# EasyEDA Pro project 500KHZ锁相环模块.eprj

# Schematic Schematic1
Board Name: Board1; Create Date: 2025-06-10; Page Name: P1; Project Name: 500KHZ锁相环模块; Schematic Name: Schematic1; Update Date: 2025-06-11; Company: 嘉立创EDA; Page Size: A4; Version: V1.0
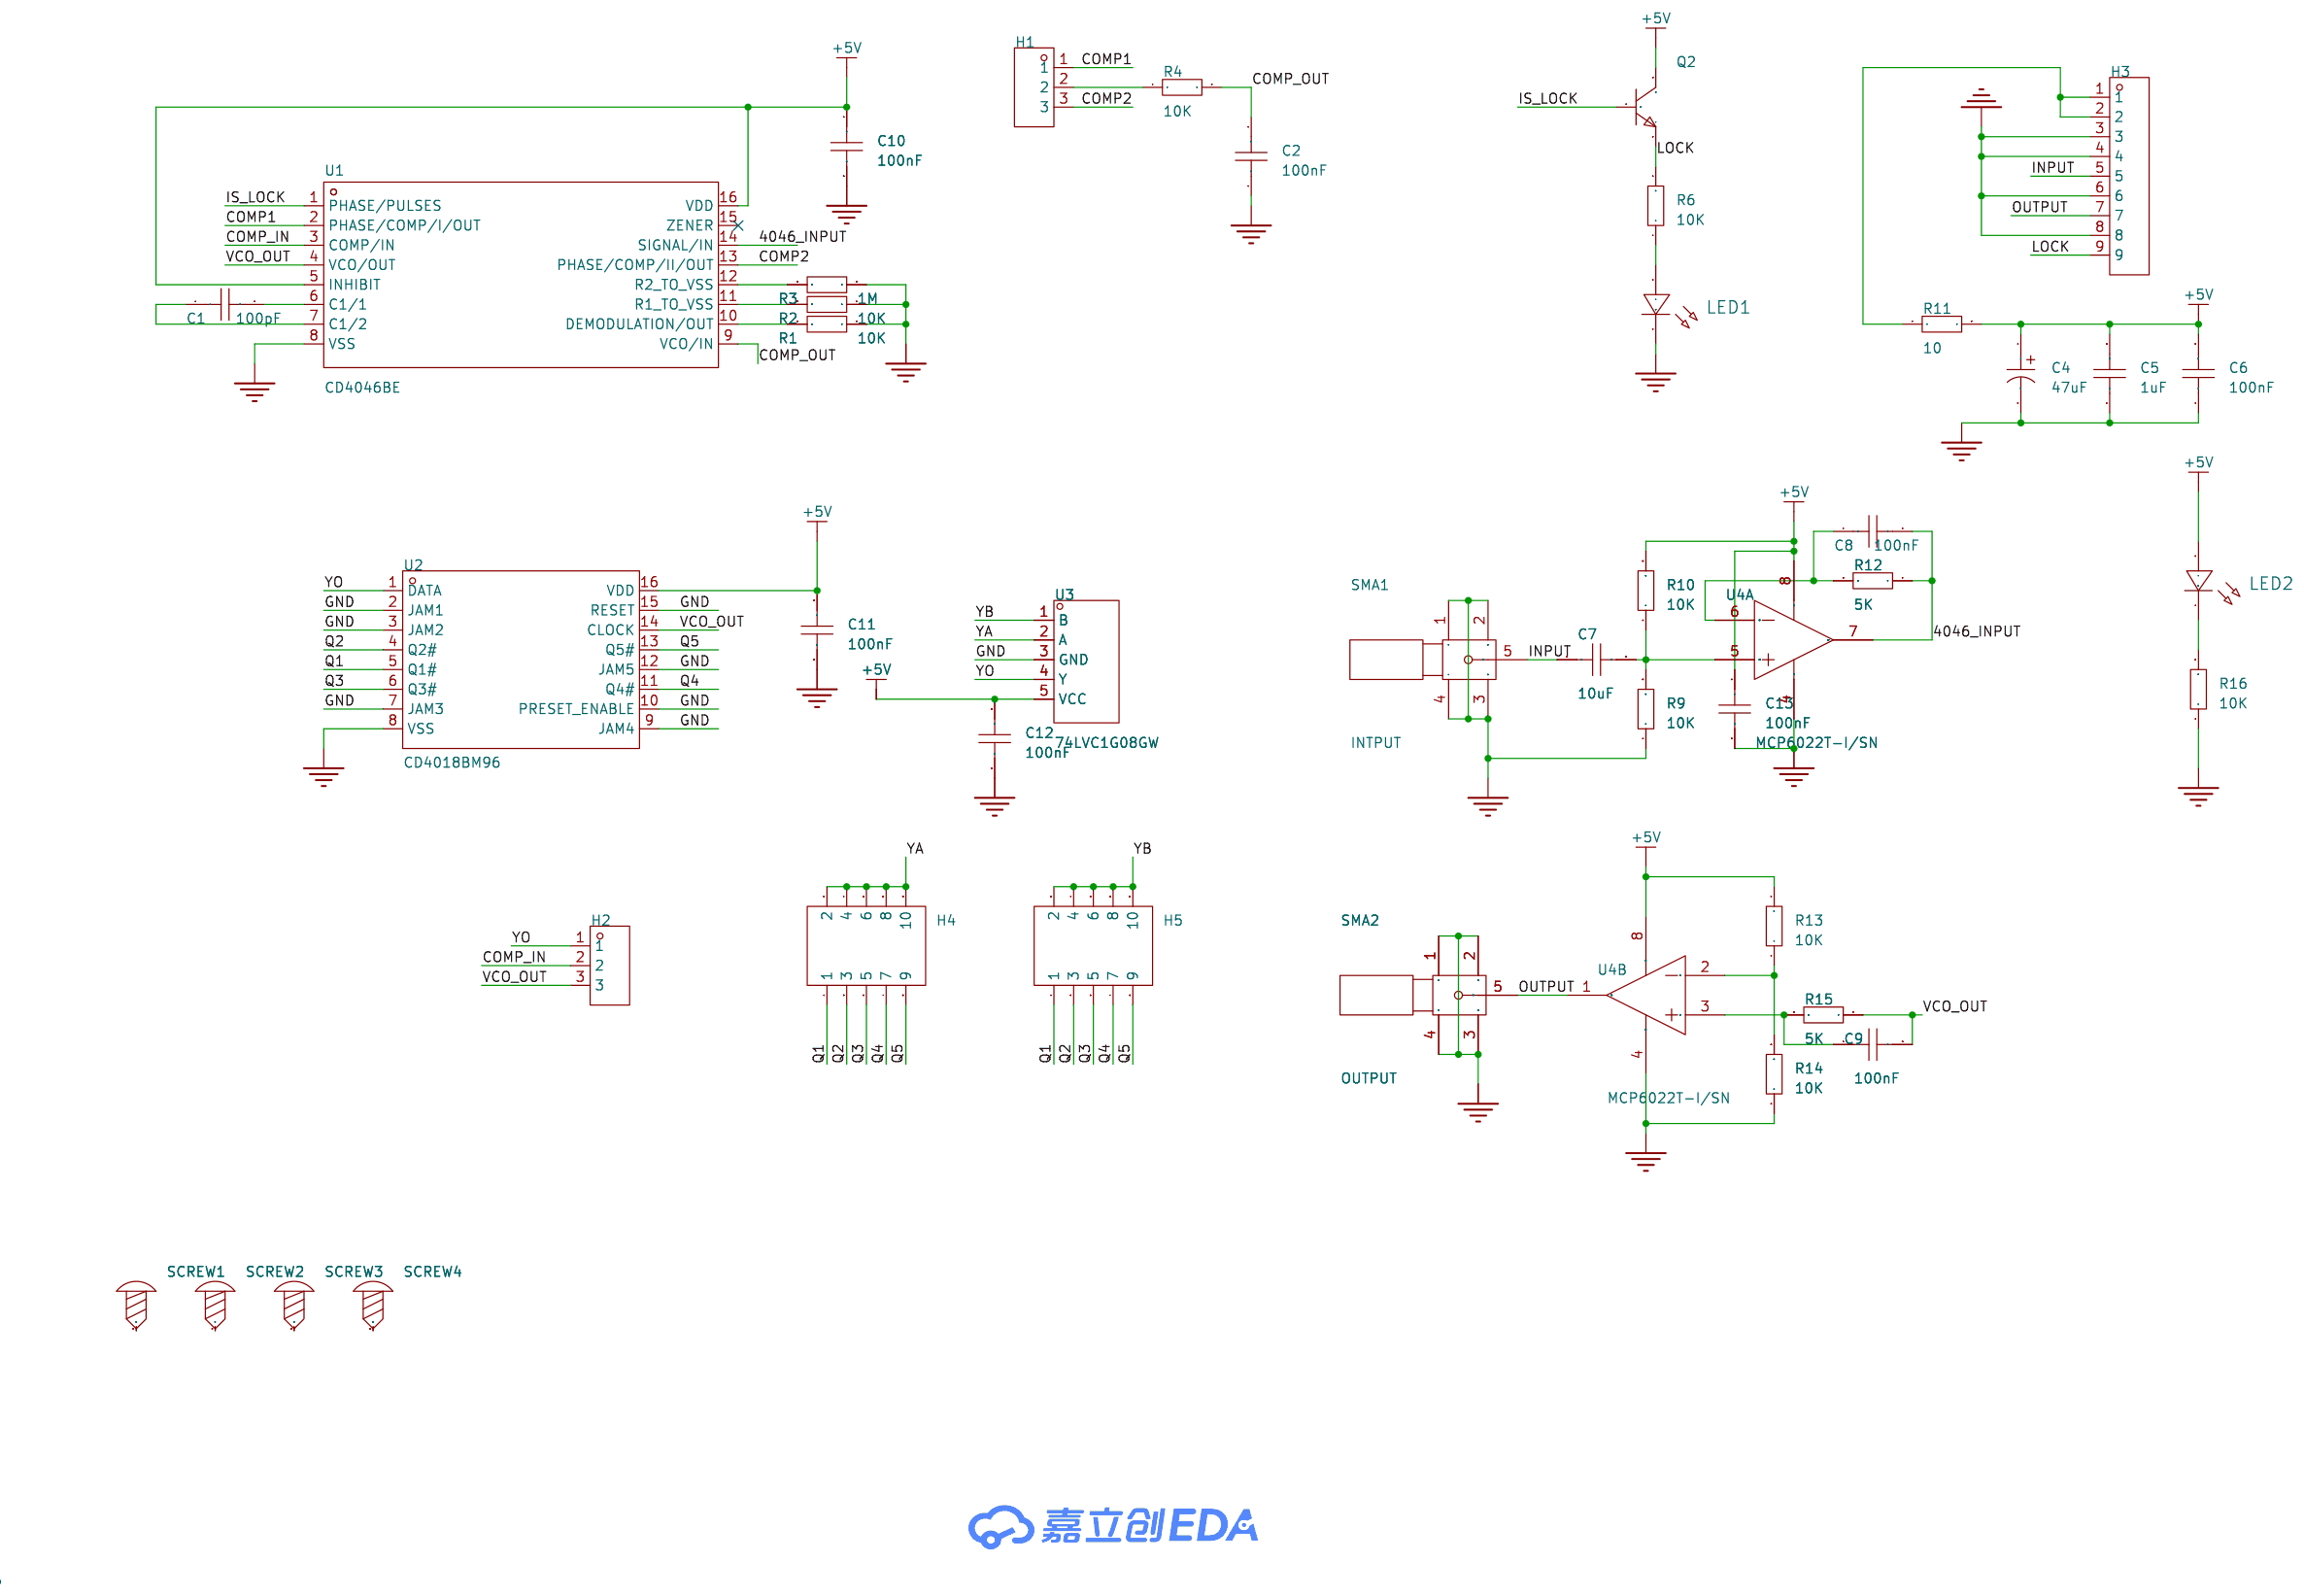
[diagram p0: schematic sheet]

## Parts
C1  100pF  [C0603]
C2  100nF  [C0603]
C4  47uF  [CAP-TH_BD6.3-P2.50-D0.5-FD]
C5  1uF  [C0603]
C6  100nF  [C0603]
C7  10uF  [C0603]
C8  100nF  [C0603]
C9  100nF  [C0603]
C10  100nF  [C0603]
C11  100nF  [C0603]
C12  100nF  [C0603]
C13  100nF  [C0603]
H1  -  [HDR-TH_3P-P2.54-V-M]
H2  -  [HDR-TH_3P-P2.54-V-M]
H3  -  [HDR-TH_9P-P2.54-V-M]
H4  -  [HDR-TH_10P-P2.54-V-F-R2-C5-S2.54]
H5  -  [HDR-TH_10P-P2.54-V-F-R2-C5-S2.54]
LED1  -  [LED_0603]
LED2  -  [LED_0603]
Q2  SS8050(RANGE:200-350)  [SOT-23-3_L2.9-W1.3-P1.90-LS2.4-BR]
R1  10K  [R0603]
R2  10K  [R0603]
R3  1M  [R0603]
R4  10K  [R0603]
R6  10K  [R0603]
R9  10K  [R0603]
R10  10K  [R0603]
R11  10  [R0603]
R12  5K  [R0603]
R13  10K  [R0603]
R14  10K  [R0603]
R15  5K  [R0603]
R16  10K  [R0603]
SCREW1  -  [M2螺丝]
SCREW2  -  [M2螺丝]
SCREW3  -  [M2螺丝]
SCREW4  -  [M2螺丝]
SMA1  INTPUT  [SMA-SMD_BWSMA-KE-P001]
SMA2  OUTPUT  [SMA-SMD_BWSMA-KE-P001]
U1  CD4046BE  [DIP-16_L19.7-W6.6-P2.54-LS10.9-BL]
U2  CD4018BM96  [SOIC-16_L9.9-W3.9-P1.27-LS6.0-BL]
U3  74LVC1G08GW  [SOT-353_L2.2-W1.4-P0.65-LS2.4-BL]
U4  MCP6022T-I/SN  [SOIC-8_L4.9-W3.9-P1.27-LS6.0-BL]  (sections 1,2)

## Library data of the parts
C1 C2 C5-C13 = CAP_0603: Supplier Footprint: 0603
C4 = CD26G1HM470E120T: LCSC Part Name: 长寿命耐高纹波耐高温，5000H-80000H at 105℃ 47uF ±20% 50V; Supplier Part: C42460502; Manufacturer: 创慧电子; Supplier Footprint: 插件,D6.3xL12mm; Datasheet: https://atta.szlcsc.com/upload/public/pdf/source/20250208/95E25F66E0D5629BBC6A4318C6E986E6.pdf; Supplier: LCSC; Tolerance: ±20%; Voltage Rating: 50V; Ripple Current: 234mA@100kHz; Equivalent Series Resistance(ESR): 710mΩ@100kHz; Pin Spacing: 2.5mm; Diameter: 6.3mm; Height - Seated (Max): 12mm; Lifetime: 8000hrs@105℃; Operating Temperature: -40℃~+105℃
H1 H2 = HDR-M_2.54_1x3P: Supplier Part: C2937625; Supplier Footprint: 插件
H3 = HDR-M_2.54-1x9P: Supplier Part: C492408; Supplier Footprint: 插件
H4 H5 = HDR-F_2.54_2x5: Supplier Part: C92270; Supplier Footprint: 插件
LED1 LED2 = LED_0603-R: Supplier Footprint: 0603
Q2 = SS8050(RANGE:200-350)_C2150: LCSC Part Name: NPN 电流:1.5A 耐压:25V hfe=200~350; Supplier Part: C2150; Manufacturer: CJ(江苏长电/长晶); Supplier Footprint: SOT-23; JLCPCB Part Class: 基础库; Datasheet: https://atta.szlcsc.com/upload/public/pdf/source/20230322/AEE86F4B043774EFF80CAEA14A37D9E9.pdf; Supplier: LCSC; Transistor Type: NPN; Collector Current (Ic): 1.5A; Collector-Emitter Breakdown Voltage (Vceo): 25V; Power Dissipation (Pd): 300mW; DC Current Gain (hFE@Ic,Vce): 200@800mA,1V; Transition Frequency (fT): 100MHz; Collector Cut-Off Current (Icbo): 100nA; Collector-Emitter Saturation Voltage (VCE(sat)@Ic,Ib): 500mV@800mA,80mA; Operating Temperature: -55℃~+150℃
R1-R4 R6 R9-R16 = Res_0603: Supplier Footprint: 0603
SCREW1-SCREW4 = M2螺丝: Supplier Footprint: 插件
SMA1 SMA2 = SMA: Supplier Part: C9900018296; JLCPCB Part Class: 扩展库; Supplier: LCSC
U1 = CD4046BE: Supplier Part: C73219; Manufacturer: TI(德州仪器); Supplier Footprint: PDIP-16; JLCPCB Part Class: 扩展库; Datasheet: https://www.ti.com/cn/lit/gpn/cd4046b; Supplier: LCSC; Output Frequency(Max): 2.4MHz; Voltage - Supply: 3V~18V; Number of Outputs: 2; Operating Temperature: -55℃~+125℃
U2 = CD4018BM96: LCSC Part Name: 8.5MHz 5位除以 N计数器; Supplier Part: C2675447; Manufacturer: TI(德州仪器); Supplier Footprint: SOIC-16; JLCPCB Part Class: 扩展库; Datasheet: https://www.ti.com/cn/lit/gpn/cd4018b; Supplier: LCSC; Logic Type: 除以 N; Supply Voltage: 3V~18V; Number of Elements: 1; Number of Bits per Element: 5; Trigger Type: 正边沿; Reset Style: 异步; Timing mode: 同步; Count Rate: 8.5MHz; Operating Temperature: -55℃~+125℃
U3 = 74LVC1G08GW: Supplier Part: C8121; Supplier Footprint: SOT-353; JLCPCB Part Class: 扩展库; Supplier: LCSC
U4 = MCP6022T-I/SN: Supplier Part: C57639; Manufacturer: MICROCHIP(美国微芯); Supplier Footprint: SOIC-8; JLCPCB Part Class: 扩展库; Datasheet: https://atta.szlcsc.com/upload/public/pdf/source/20151020/1457707482040.pdf; Supplier: LCSC; Number of Channels: 双路; Maximum Power Supply Range (Vdd-Vss): 7V; Vos - Input Offset Voltage: 500uV; Input Offset Voltage Drift(Vos TC): 3.5uV/℃; Slew Rate: 7V/us; Ib - Input Bias Current: 1pA; Noise density(eN): 8.7nV/√Hz@10kHz; Common Mode Rejection Ratio(CMRR): 90dB; Operating Temperature: -40℃~+125℃; Single supply: 2.5V~5.5V

## Nets
+5V: C4.1 C5.2 C6.2 C10.1 C11.1 C12.1 C13.1 LED2.2(A) Q2.3(C) R10.2 R11.2 R13.2 U1.5(INHIBIT) U1.16(VDD) U2.16(VDD) U3.5(VCC) U4.8(VDD)
GND: C2.1 C4.2 C5.1 C6.1 C10.2 C11.2 C12.2 C13.2 H3.3 H3.4 H3.6 H3.8 LED1.1(C) R1.1 R2.1 R3.1 R9.1 R14.1 R16.1 SMA1.1 SMA1.2 SMA1.3 SMA1.4 SMA2.1 SMA2.2 SMA2.3 SMA2.4 U1.8(VSS) U2.2(JAM1) U2.3(JAM2) U2.7(JAM3) U2.8(VSS) U2.9(JAM4) U2.10(PRESET ENABLE) U2.12(JAM5) U2.15(RESET) U3.3(GND) U4.4(VSS)
4046_INPUT: C8.2 R12.1 U1.14(SIGNAL/IN) U4.7(VOUTB)
COMP1: H1.1 U1.2(PHASE/COMP/I/OUT)
COMP2: H1.3 U1.13(PHASE/COMP/II/OUT)
COMP_IN: H2.2 U1.3(COMP/IN)
COMP_OUT: C2.2 R4.2 U1.9(VCO/IN)
INPUT: C7.1 H3.5 SMA1.5
IS_LOCK: Q2.1(B) U1.1(PHASE/PULSES)
LOCK: H3.9 Q2.2(E) R6.2
OUTPUT: H3.7 SMA2.5 U4.1(VOUTA)
Q1: H4.1 H5.1 U2.5(Q1#)
Q2: H4.3 H5.3 U2.4(Q2#)
Q3: H4.5 H5.5 U2.6(Q3#)
Q4: H4.7 H5.7 U2.11(Q4#)
Q5: H4.9 H5.9 U2.13(Q5#)
VCO_OUT: C9.2 H2.3 R15.1 U1.4(VCO/OUT) U2.14(CLOCK)
YA: H4.2 H4.4 H4.6 H4.8 H4.10 U3.2(A)
YB: H5.2 H5.4 H5.6 H5.8 H5.10 U3.1(B)
YO: H2.1 U2.1(DATA) U3.4(Y)
$1N301: C1.2 U1.6(C1/1)
$1N305: C1.1 U1.7(C1/2)
$1N361: R1.2 U1.10(DEMODULATION/OUT)
$1N433: R3.2 U1.12(R2 TO VSS)
$1N437: R2.2 U1.11(R1 TO VSS)
$1N660: H1.2 R4.1
$1N1210: LED1.2(A) R6.1
$1N2399: H3.1 H3.2 R11.1
$1N3085: C7.2 R9.2 R10.1 U4.5(VINB+)
$1N3391: C8.1 R12.2 U4.6(VINB-)
$1N3511: R13.1 R14.2 U4.2(VINA-)
$1N3575: C9.1 R15.2 U4.3(VINA+)
$1N3865: LED2.1(C) R16.2

Not connected (* = marked no-connect by the designer): SCREW1 1; SCREW2 1; SCREW3 1; SCREW4 1; U1 15(ZENER)*

# Board PCB1
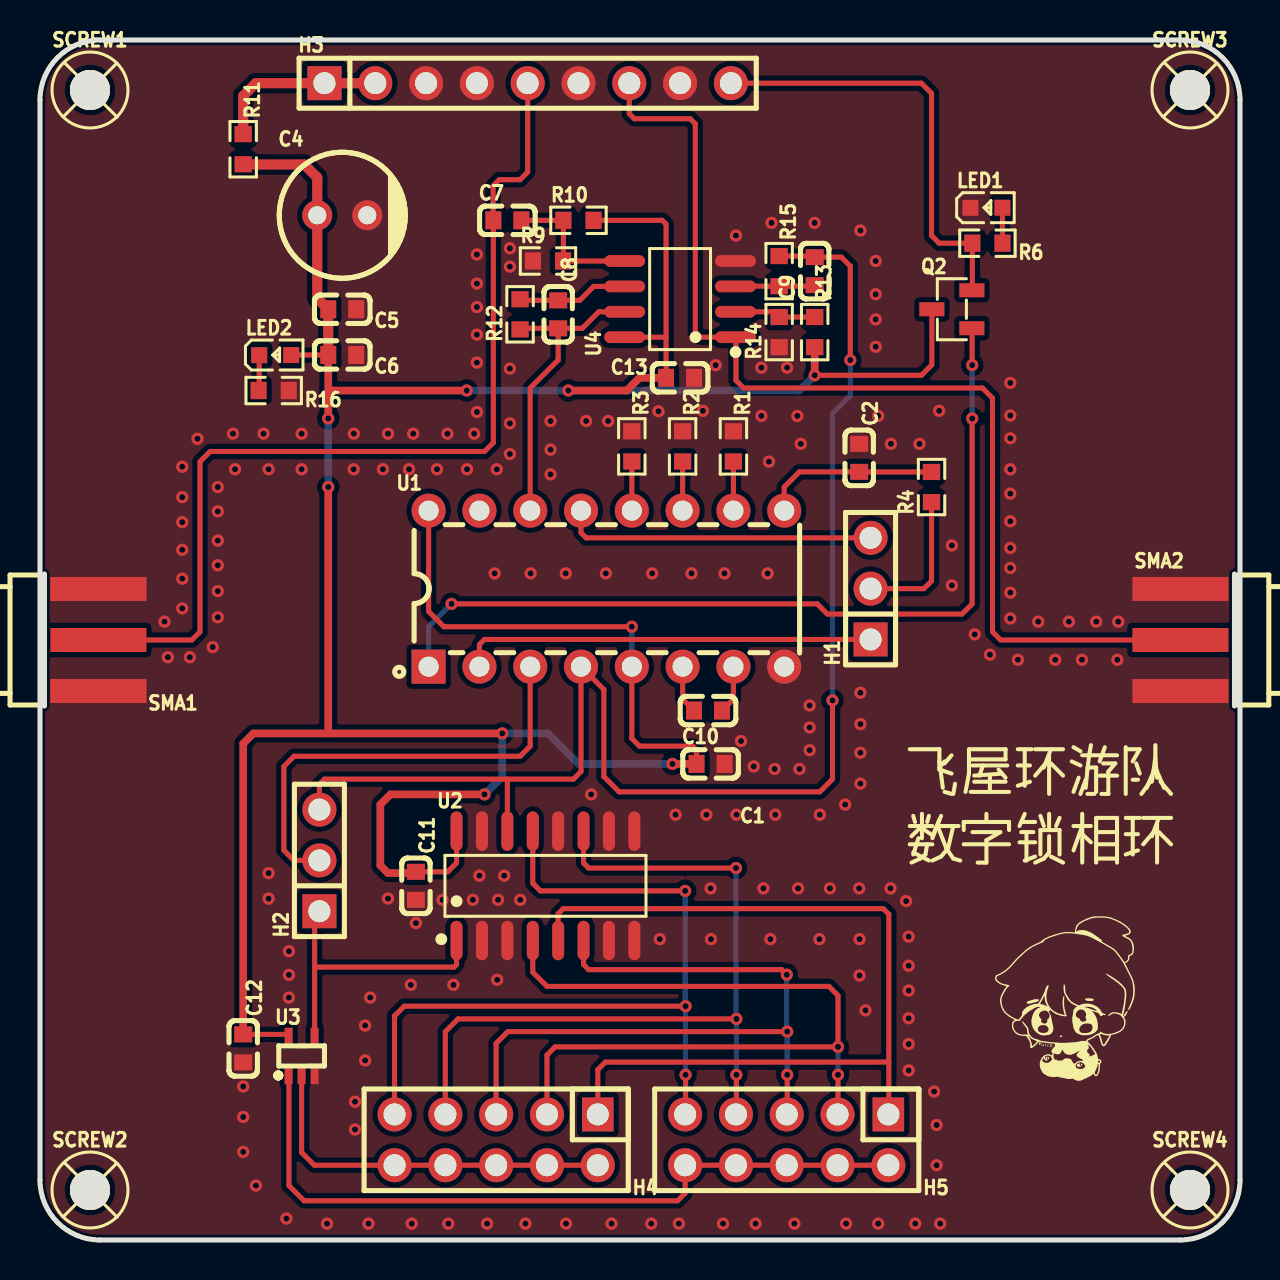
[diagram p1: board, top side]
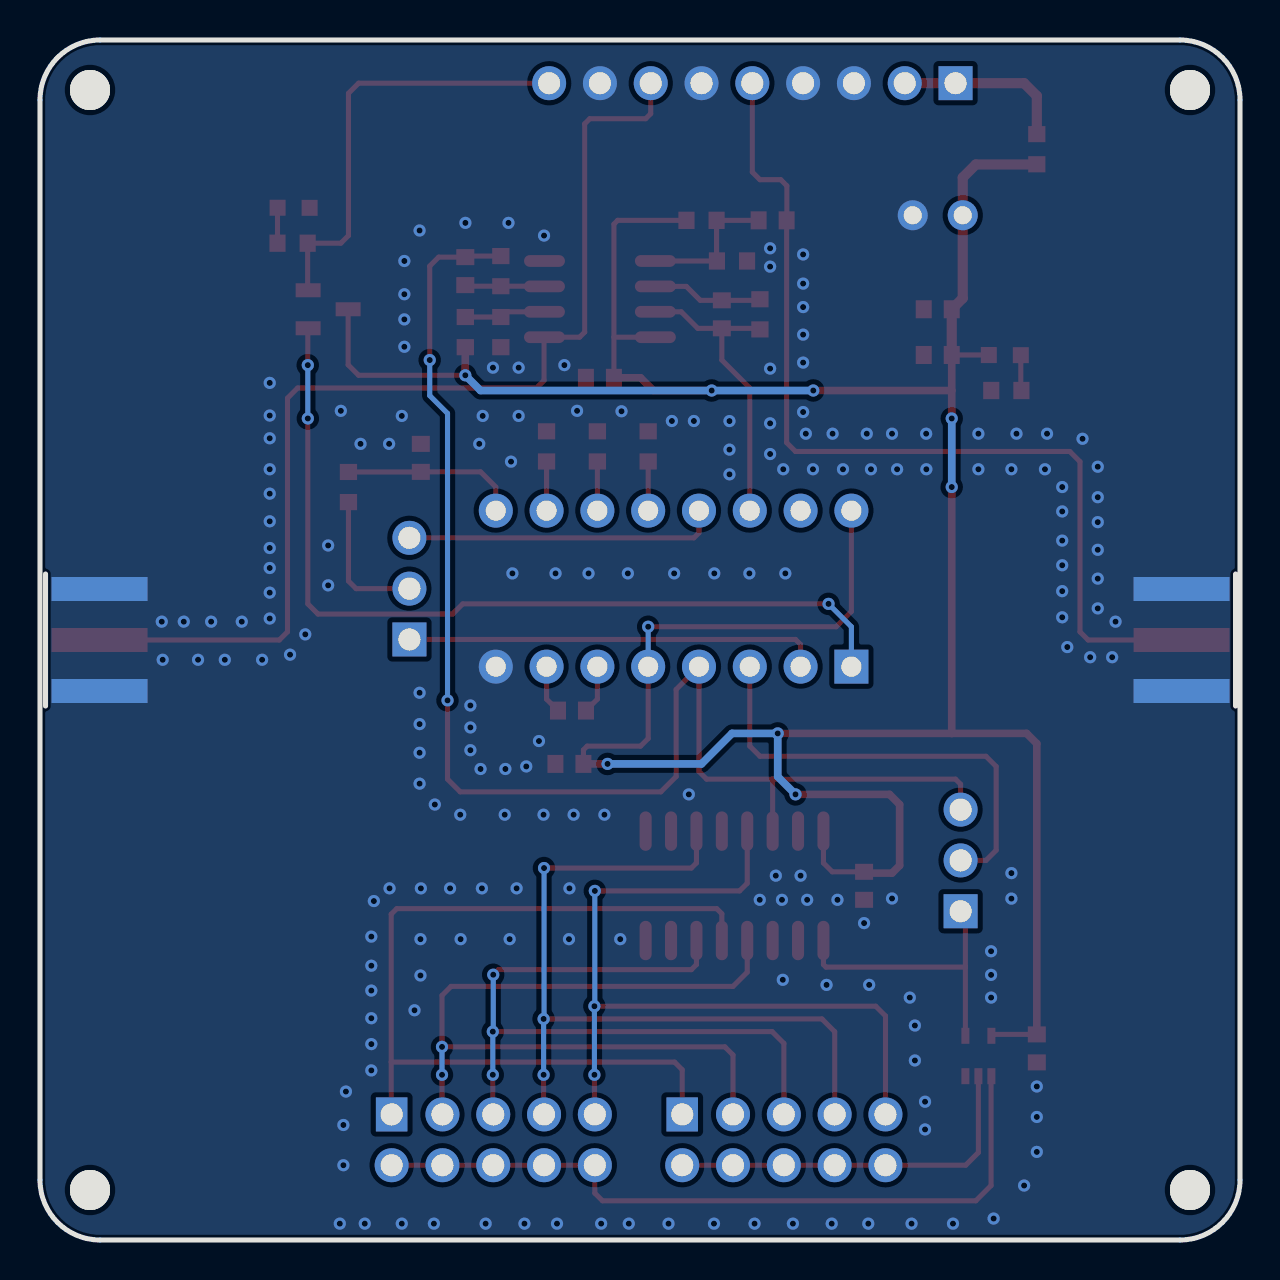
[diagram p2: board, bottom side, seen from below]

Outline 60 x 60 mm; copper layers: Top Layer, Bottom Layer. Coordinates in mm from the lower left corner of the outline.
Outline path: 0,57 0,3 arc(0.88,0.88) 3,0 57,0 arc(59.12,0.88) 60,3 60,57 arc(59.12,59.12) 57,60 3,60 arc(0.88,59.12) 0,57
Stack: Top Layer 0.035mm / Dielectric1 1.51mm FR4 er 4.5 / Bottom Layer 0.035mm

## Design rules (mm)
template: 自定义配置
spacing copperThickness1oz (default): track to track 0.102, other pairs 0.152 to 0.3
spacing copperThickness2oz: track to track 0.203, other pairs 0.152 to 0.3
track width copperThickness1oz (default): min 0.127, default 0.254, max 2.54
track width copperThickness2oz: min 0.203, default 0.254, max 2.54
differential pair differentialPair (default): width min 0.127, default 0.254, max 2.54; gap min 0.152, default 0.152
via viaSize (default): diameter min 0.5, default 0.61, max 10; hole min 0.3, default 0.305, max 6.3
pour e558 uses main
pour e578 uses main

## Placement (name value [footprint] x y rotation side)
C1  100pF  [C0603]  33.4 26.47 180 top
C2  100nF  [C0603]  40.96 39.11 270 top
C4  47uF  [CAP-TH_BD6.3-P2.50-D0.5-FD]  15.11 51.24 0 top
C5  1uF  [C0603]  15.11 46.54 180 top
C6  100nF  [C0603]  15.11 44.25 180 top
C7  10uF  [C0603]  23.37 50.98 0 top
C8  100nF  [C0603]  25.91 46.28 270 top
C9  100nF  [C0603]  38.74 48.44 90 top
C10  100nF  [C0603]  33.53 23.81 0 top
C11  100nF  [C0603]  18.8 17.71 270 top
C12  100nF  [C0603]  10.16 9.58 270 top
C13  100nF  [C0603]  32 43.11 0 top
H1  -  [HDR-TH_3P-P2.54-V-M]  41.53 32.57 90 top
H2  -  [HDR-TH_3P-P2.54-V-M]  13.97 18.98 90 top
H3  -  [HDR-TH_9P-P2.54-V-M]  24.38 57.84 0 top
H4  -  [HDR-TH_10P-P2.54-V-F-R2-C5-S2.54]  22.81 5.01 180 top
H5  -  [HDR-TH_10P-P2.54-V-F-R2-C5-S2.54]  37.34 5.01 180 top
LED1  -  [LED_0603]  47.37 51.62 0 top
LED2  -  [LED_0603]  11.81 44.25 0 top
Q2  SS8050(RANGE:200-350)  [SOT-23-3_L2.9-W1.3-P1.90-LS2.4-BR]  45.59 46.54 0 top
R1  10K  [R0603]  34.67 39.68 270 top
R2  10K  [R0603]  32.13 39.68 270 top
R3  1M  [R0603]  29.59 39.68 270 top
R4  10K  [R0603]  44.58 37.65 90 top
R6  10K  [R0603]  47.37 49.84 180 top
R9  10K  [R0603]  25.4 48.95 0 top
R10  10K  [R0603]  26.92 50.98 0 top
R11  10  [R0603]  10.16 54.54 270 top
R12  5K  [R0603]  24 46.28 90 top
R13  10K  [R0603]  38.74 45.39 270 top
R14  10K  [R0603]  36.96 45.39 90 top
R15  5K  [R0603]  36.96 48.44 270 top
R16  10K  [R0603]  11.68 42.47 180 top
SCREW1  -  [M2螺丝]  2.5 57.5 0 top
SCREW2  -  [M2螺丝]  2.5 2.5 0 top
SCREW3  -  [M2螺丝]  57.5 57.5 0 top
SCREW4  -  [M2螺丝]  57.5 2.5 0 top
SMA1  INTPUT  [SMA-SMD_BWSMA-KE-P001]  2.92 30 180 top
SMA2  OUTPUT  [SMA-SMD_BWSMA-KE-P001]  57.02 30 0 top
U1  CD4046BE  [DIP-16_L19.7-W6.6-P2.54-LS10.9-BL]  28.32 32.57 0 top
U2  CD4018BM96  [SOIC-16_L9.9-W3.9-P1.27-LS6.0-BL]  25.27 17.71 0 top
U3  74LVC1G08GW  [SOT-353_L2.2-W1.4-P0.65-LS2.4-BL]  13.08 9.2 0 top
U4  MCP6022T-I/SN  [SOIC-8_L4.9-W3.9-P1.27-LS6.0-BL]  32 47.05 90 top

## Footprints (pads in the part's own frame, mm; a bottom-side part is the same pattern mirrored in y, then rotated)
C0603
  rect 0.8x0.9 smd: 1(-0.7,0) 2(0.7,0)
CAP-TH_BD6.3-P2.50-D0.5-FD
  round 1.5 hole 0.9: 1(-1.25,0) 2(1.25,0)
DIP-16_L19.7-W6.6-P2.54-LS10.9-BL
  rect 1.7x1.7 hole 1: 1(-8.89,-3.9)
  round 1.7 hole 1: 2(-6.35,-3.9) 3(-3.81,-3.9) 4(-1.27,-3.9) 5(1.27,-3.9) 6(3.81,-3.9) 7(6.35,-3.9) 8(8.89,-3.9) 9(8.89,3.9) 10(6.35,3.9) 11(3.81,3.9) 12(1.27,3.9) 13(-1.27,3.9) 14(-3.81,3.9) 15(-6.35,3.9) 16(-8.89,3.9)
HDR-TH_3P-P2.54-V-M
  rect 1.7x1.7 hole 1.1: 1(-2.54,0)
  round 1.7 hole 1.1: 2(0,0) 3(2.54,0)
HDR-TH_9P-P2.54-V-M
  rect 1.7x1.7 hole 1.1: 1(-10.16,0)
  round 1.7 hole 1.1: 2(-7.62,0) 3(-5.08,0) 4(-2.54,0) 5(0,0) 6(2.54,0) 7(5.08,0) 8(7.62,0) 9(10.16,0)
HDR-TH_10P-P2.54-V-F-R2-C5-S2.54
  rect 1.575x1.7 hole 1.1: 1(-5.08,-1.27)
  round 1.7 hole 1.1: 2(-5.08,1.27) 3(-2.54,-1.27) 4(-2.54,1.27) 5(0,-1.27) 6(0,1.27) 7(2.54,-1.27) 8(2.54,1.27) 9(5.08,-1.27) 10(5.08,1.27)
LED_0603
  rect 0.8x0.8 smd: 1(-0.851,-0.01) 2(0.75,-0.005)
M2螺丝
  round 2 hole 2: 1(0,0)
R0603
  rect 0.806x0.864 smd: 1(-0.753,0) 2(0.753,0)
SMA-SMD_BWSMA-KE-P001
  rect 4.8x1.2 smd: 1(0,-2.55) 2(0,2.55) 5(0,0)
  rect 4.8x1.2 smd far side: 3(0,2.55) 4(0,-2.55)
SOIC-8_L4.9-W3.9-P1.27-LS6.0-BL
  oval 0.588x2.045 smd: 1(-1.905,-2.772) 2(-0.635,-2.772) 3(0.635,-2.772) 4(1.905,-2.772) 5(1.905,2.772) 6(0.635,2.772) 7(-0.635,2.772) 8(-1.905,2.772)
SOIC-16_L9.9-W3.9-P1.27-LS6.0-BL
  oval 0.602x1.971 smd: 1(-4.445,-2.736) 2(-3.175,-2.736) 3(-1.905,-2.736) 4(-0.635,-2.736) 5(0.635,-2.736) 6(1.905,-2.736) 7(3.175,-2.736) 8(4.445,-2.736) 9(4.445,2.736) 10(3.175,2.736) 11(1.905,2.736) 12(0.635,2.736) 13(-0.635,2.736) 14(-1.905,2.736) 15(-3.175,2.736) 16(-4.445,2.736)
SOT-23-3_L2.9-W1.3-P1.90-LS2.4-BR
  rect 1.25x0.7 smd: 1(1,-0.95) 2(1,0.95) 3(-1,0)
SOT-353_L2.2-W1.4-P0.65-LS2.4-BL
  rect 0.4x0.8 smd: 1(-0.65,-1.01) 2(0,-1.01) 3(0.65,-1.01) 4(0.65,1.01) 5(-0.65,1.01)

## Nets
As in the schematic.

Pads without a net: SCREW1 1; SCREW2 1; SCREW3 1; SCREW4 1; U1 15

## Via types
v1: diameter 0.61, hole 0.305, Top Layer to Bottom Layer, 210 vias

## Routing (per net, layer and track width the routed paths; a pad name or vN(x,y) marks a point on that pad's centre or on a via; arc(x,y) is an arc through that point)
+5V: length 170.6
  Top Layer w0.254: C13.1 31.3,45.14 ; 31.3,45.14 31.3,50.79 31.12,50.98 R10.2 ; 31.3,45.14 U4.8 ; v1(29.59,30.66) 20.19,30.66 19.43,31.42 19.43,36.47 ; U2.16 20.83,18.85 20.38,18.41 C11.1 ; U1.5 29.59,25.08 29.97,24.69 32.64,24.69 32.83,24.5 C10.1 ; LED2.2 12.57,44.25 C6.2 ; C12.1 12.36,10.28 12.43,10.21 ; v1(38.74,43.24) 44.07,43.24 44.59,43.76 Q2.3
  Top Layer w0.381: 14.41,42.47 v1(14.41,41.08) ; 14.41,42.47 v1(21.34,42.47) ; 14.41,42.47 C6.2 ; C11.1 18.73,18.34 17.4,18.34 17.02,18.72 17.02,21.77 17.53,22.28 v1(22.22,22.28) ; C13.1 29.97,43.11 29.34,42.47 v1(26.42,42.47) ; v1(31.62,23.81) C10.1 ; v1(38.74,43.24) R13.2 ; 14.41,25.33 10.67,25.33 10.16,24.82 C12.1 ; 14.41,25.33 v1(14.41,37.65) ; 14.41,25.33 v1(23.11,25.33)
  Top Layer w0.508: R11.2 10.17,53.78 13.21,53.78 13.86,53.12 C4.1 13.86,47.09 C5.2 C6.2
  Bottom Layer w0.254: U1.5 v1(29.59,30.66)
  Bottom Layer w0.381: v1(31.62,23.81) 26.92,23.81 25.4,25.33 v1(23.11,25.33) 23.11,23.17 v1(22.22,22.28) ; v1(38.74,43.24) 37.97,42.47 v1(26.42,42.47) v1(21.34,42.47) ; v1(14.41,41.08) v1(14.41,37.65)
GND:
  vias: v1(6.22,30.92) v1(6.39,29.14) v1(7.11,38.66) v1(7.11,37.14) v1(7.11,35.89) v1(7.11,34.51) v1(7.11,33.07) v1(7.11,31.58) v1(7.49,29.14) v1(7.87,40.06) v1(8.64,29.65) v1(8.89,37.65) v1(8.89,36.43) v1(8.89,34.97) v1(8.89,33.74) v1(8.89,32.44) v1(8.89,31.14) v1(9.65,40.31) v1(9.75,38.54) v1(10.16,7.68) v1(10.16,6.15) v1(10.16,4.4) v1(10.79,2.72) v1(11.18,40.31) v1(11.43,38.54) v1(11.43,18.34) v1(11.43,17.07) v1(12.32,1.07) v1(12.45,14.44) v1(12.45,13.26) v1(12.45,12.12) v1(13.08,40.31) v1(13.08,38.54) v1(14.35,0.82) v1(15.69,40.31) v1(15.68,38.54) v1(15.75,6.91) v1(15.75,5.53) v1(16.26,10.72) v1(16.26,8.98) v1(16.42,0.82) v1(16.51,12.12) v1(17.15,38.54) v1(17.4,40.31) v1(17.4,17.07) v1(18.45,38.54) v1(18.54,12.76) v1(18.59,0.82) v1(18.66,40.31) v1(18.8,15.84) v1(19.85,38.54) v1(20.13,17.01) v1(20.37,40.31) v1(20.41,0.82) v1(20.67,12.76) v1(21.35,38.54) v1(21.64,17.01) v1(21.71,40.31) v1(21.84,49.28) v1(21.84,47.82) v1(21.84,46.65) v1(21.84,45.27) v1(21.84,43.87) v1(21.84,41.4) v1(21.97,18.22) v1(22.35,0.82) v1(22.73,33.33) v1(22.84,38.54) v1(22.9,17.01) v1(22.86,13.01) v1(23.21,18.22) v1(23.5,49.59) v1(23.5,48.67) v1(23.5,43.57) v1(23.5,40.83) v1(23.5,39.3) v1(24.01,17.01) v1(24.27,0.82) v1(24.53,33.33) v1(25.53,40.95) v1(25.53,39.52) v1(25.53,38.28) v1(26.29,33.33) v1(26.3,0.82) v1(27.31,40.95) v1(27.56,22.28) v1(28.29,33.33) v1(28.41,40.95) v1(28.57,0.82) v1(30.61,33.33) v1(30.56,0.82) v1(30.92,41.44) v1(30.99,15.04) v1(31.78,21.27) v1(31.94,0.82) v1(32.57,33.33) v1(33.15,41.46) v1(33.32,21.27) v1(33.53,17.58) v1(33.55,15.04) v1(33.78,43.74) v1(34.22,33.33) v1(34.15,0.82) v1(34.8,50.22) v1(34.82,21.27) v1(35.05,24.95) v1(35.69,23.68) v1(35.78,0.82) v1(36.07,43.62) v1(36.07,41.2) v1(36.17,17.58) v1(36.45,38.92) v1(36.38,33.33) v1(36.52,15.04) v1(36.58,50.86) v1(36.73,23.55) v1(36.76,21.27) v1(37.35,43.62) v1(37.72,0.82) v1(37.87,41.2) v1(37.9,17.58) v1(38.04,39.81) v1(37.97,23.55) v1(38.48,26.73) v1(38.48,25.63) v1(38.48,24.49) v1(38.73,50.86) v1(38.99,21.27) v1(38.97,15.04) v1(39.5,17.58) v1(40.26,21.77) v1(40.31,0.82) v1(41.02,50.47) v1(41.02,27.36) v1(41.02,25.8) v1(41.02,24.36) v1(41.02,22.82) v1(40.96,17.58) v1(40.98,15.04) v1(40.98,13.23) v1(41.28,11.49) v1(41.78,48.95) v1(41.78,47.29) v1(41.78,46.03) v1(41.78,44.66) v1(41.91,41.2) v1(41.91,0.82) v1(42.54,39.81) v1(42.52,17.58) v1(43.31,16.95) v1(43.43,15.17) v1(43.43,13.72) v1(43.43,12.47) v1(43.43,11.09) v1(43.43,9.79) v1(43.43,8.48) v1(43.76,0.82) v1(43.97,39.81) v1(44.7,7.42) v1(44.83,5.75) v1(44.83,3.74) v1(44.96,41.46) v1(45.01,0.82) v1(45.59,34.73) v1(45.59,32.73) v1(46.74,30.28) v1(47.5,29.27) v1(48.51,42.86) v1(48.51,41.22) v1(48.51,40.09) v1(48.51,38.54) v1(48.51,37.32) v1(48.51,35.93) v1(48.51,34.6) v1(48.51,33.6) v1(48.51,32.37) v1(48.51,31.07) v1(48.9,29.01) v1(49.91,30.92) v1(50.76,29.01) v1(51.44,30.92) v1(52.1,29.01) v1(52.81,30.92) v1(53.91,30.92) v1(53.87,29.01)
4046_INPUT: length 15.3
  Top Layer w0.254: U4.7 27.94,46.41 27.11,45.58 C8.2 ; C8.2 25.91,44 24.51,42.6 U1.14 ; C8.2 24.06,45.58 R12.1
COMP1: length 20.8
  Top Layer w0.254: H1.1 22.22,30.03 21.97,29.77 U1.2
COMP2: length 15.7
  Top Layer w0.254: U1.13 27.05,35.36 27.31,35.11 H1.3
COMP_IN: length 22.9
  Top Layer w0.254: U1.3 24.51,24.69 24,24.19 12.7,24.19 12.19,23.68 12.19,19.49 12.7,18.98 H2.2
COMP_OUT: length 8.9
  Top Layer w0.254: R4.2 40.96,38.4 C2.2 37.97,38.41 37.21,37.65 U1.9
INPUT: length 48.1
  Top Layer w0.254: SMA1.5 7.59,30 8,30.41 8,38.92 8.51,39.43 22.22,39.43 22.67,39.87 C7.1 22.66,50.99 22.66,52.71 22.96,53.02 24,53.02 24.38,53.4 H3.5
IS_LOCK: length 43.9
  Top Layer w0.254: v1(46.61,41.08) 46.61,31.81 46.1,31.3 39.37,31.3 38.86,31.81 v1(20.57,31.81) ; Q2.1 46.61,45.57 v1(46.61,43.74)
  Bottom Layer w0.254: v1(20.57,31.81) 19.43,30.66 19.43,28.67 ; v1(46.61,41.08) v1(46.61,43.74)
LOCK: length 21.9
  Top Layer w0.254: Q2.2 46.62,47.51 R6.2 44.96,49.84 44.58,50.22 44.58,57.33 44.07,57.84 H3.9
OUTPUT: length 54.2
  Top Layer w0.254: H3.7 29.46,56.32 29.72,56.06 32.51,56.06 32.77,55.81 32.77,45.39 33.02,45.14 U4.1 34.8,45.12 34.8,42.98 35.18,42.6 47.12,42.6 47.62,42.09 47.62,30.41 48.03,30 SMA2.5
Q1: length 43.6
  Top Layer w0.254: U2.5 25.91,16.31 26.16,16.57 42.16,16.57 42.44,16.29 42.44,8.9 ; 27.89,7.02 27.89,7.02 27.89,8.51 28.27,8.9 42.44,8.9 ; 42.44,8.9 42.44,7.02
Q2: length 39.5
  Top Layer w0.254: 39.9,7.02 v1(39.9,8.26) ; 25.35,7.02 25.35,7.02 25.35,9.25 25.76,9.66 v1(39.9,9.66) 39.9,12.23 39.45,12.68 25.35,12.68 24.64,13.39 U2.4
  Bottom Layer w0.254: v1(39.9,8.26) v1(39.9,9.66)
Q3: length 35.4
  Top Layer w0.254: 22.81,7.02 22.81,9.83 23.39,10.42 v1(37.36,10.42) ; U2.6 27.18,13.77 27.43,13.52 37.08,13.52 v1(37.34,13.26) ; 37.36,7.02 v1(37.36,8.26)
  Bottom Layer w0.254: v1(37.34,13.26) 37.34,10.44 v1(37.36,10.42) v1(37.36,8.26)
Q4: length 39.1
  Top Layer w0.254: U2.11 27.18,18.85 27.43,18.6 v1(34.8,18.6) ; v1(34.82,11.05) 20.9,11.05 20.27,10.42 20.27,7.02 ; 34.82,7.02 v1(34.82,8.26)
  Bottom Layer w0.254: v1(34.8,18.6) 34.8,11.08 v1(34.82,11.05) v1(34.82,8.26)
Q5: length 39.8
  Top Layer w0.254: v1(32.26,17.45) 25.02,17.45 24.64,17.84 U2.13 ; v1(32.28,11.69) 18.21,11.69 17.73,11.2 17.73,7.02 ; 32.28,7.02 v1(32.28,8.26)
  Bottom Layer w0.254: v1(32.28,8.26) v1(32.28,11.69) 32.26,11.71 v1(32.26,17.45)
VCO_OUT: length 70.2
  Top Layer w0.254: R15.1 38.68,49.2 C9.2 40.07,49.14 40.51,48.7 v1(40.51,44) ; 23.37,23.04 U2.14 ; 23.37,23.04 14.22,23.04 13.97,22.79 H2.3 ; 23.37,23.04 26.67,23.04 27.05,23.42 U1.4 28.19,27.53 28.19,23.17 28.96,22.41 38.99,22.41 39.62,23.04 v1(39.62,26.98)
  Bottom Layer w0.254: v1(40.51,44) 40.51,42.22 39.62,41.33 v1(39.62,26.98)
YA: length 18.9
  Top Layer w0.254: 27.89,3.74 13.72,3.74 13.08,4.37 U3.2
YB: length 37.3
  Top Layer w0.254: 42.42,3.74 32.26,3.74 32.26,2.34 31.88,1.96 13.21,1.96 12.45,2.72 12.45,8.18 12.43,8.19
YO: length 14.7
  Top Layer w0.254: H2.1 13.73,16.2 13.73,13.64 ; U2.1 20.83,13.77 20.7,13.64 13.74,13.64 13.73,13.64 ; 13.73,13.64 U3.4
$1N301: length 2.4
  Top Layer w0.254: U1.6 32.13,27.04 32.7,26.47
$1N305: length 2.4
  Top Layer w0.254: C1.1 34.67,27.04 U1.7
$1N361: length 2.5
  Top Layer w0.254: U1.10 R1.2
$1N433: length 2.5
  Top Layer w0.254: U1.12 R3.2
$1N437: length 2.5
  Top Layer w0.254: U1.11 R2.2
$1N660: length 7.2
  Top Layer w0.254: H1.2 44.2,32.57 44.58,32.95 R4.1
$1N1210: length 1.8
  Top Layer w0.254: LED1.2 48.12,51.61 R6.1
$1N2399: length 8.8
  Top Layer w0.508: R11.1 10.16,57.21 10.79,57.84 H3.1 H3.2
$1N3085: length 7.2
  Top Layer w0.254: U4.5 R9.2 26.17,48.97 R10.1 C7.2
$1N3391: length 5.5
  Top Layer w0.254: R12.2 24.06,46.98 C8.1 26.99,46.98 27.69,47.68 29.23,47.68
$1N3511: length 4.1
  Top Layer w0.254: R13.1 R14.2 36.69,46.41 U4.2
$1N3575: length 4
  Top Layer w0.254: C9.1 38.68,47.69 R15.2 34.78,47.69 34.78,47.68
$1N3865: length 1.8
  Top Layer w0.254: R16.2 10.96,42.5 LED2.1

## Copper pours and planes (outline as drawn; the poured copper is in the pictures)
GND on Top Layer: -2.79,61.65 62.87,61.65 62.87,-2.48 -2.79,-2.48
GND on Bottom Layer: -2.92,62.16 62.25,62.16 62.25,-2.16 -2.92,-2.16

## Text on the board
Top Silkscreen Layer: 飞屋环游队 / 数字锁相环
